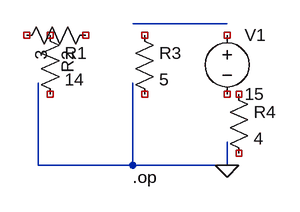
[diagram p0: schematic 01_circuit_generated-by-gemini.asc]
01_circuit_generated-by-gemini.asc, the LTspice schematic file:
Version 4
SHEET 1 880 680
WIRE 160 32 288 32
WIRE 32 224 160 224
WIRE 160 224 288 224
WIRE 32 112 32 224
WIRE 160 112 160 224
WIRE 288 192 288 224
SYMBOL res 32 32 R0
SYMATTR InstName R1
SYMATTR Value 14
SYMBOL res 112 32 R90
SYMATTR InstName R2
SYMATTR Value 3
SYMBOL res 160 32 R0
SYMATTR InstName R3
SYMATTR Value 5
SYMBOL voltage 288 32 R0
SYMATTR InstName V1
SYMATTR Value 15
SYMBOL res 288 112 R0
SYMATTR InstName R4
SYMATTR Value 4
FLAG 288 224 0
TEXT 160 240 Left 2 !.op

The netlist it stands for:
* 01_circuit_generated-by-gemini.asc
R1 NC_01 NC_02 14
R2 NC_03 NC_04 3
R3 NC_05 NC_06 5
V1 NC_07 NC_08 15
R4 NC_09 NC_10 4
.op
.backanno
.end